# EAGLE design StickIt-PS2 (EAGLE 5.11)
AUTHOR: Dave Vandenbout / XESS Corp.; DIGIKEY#: 742C083331JPCT-ND; MANF: CTS Resistor Products; MANF#: 742C083331JPTR; MOUSER#: 774-742C083331JP; VERSION#: 1.0
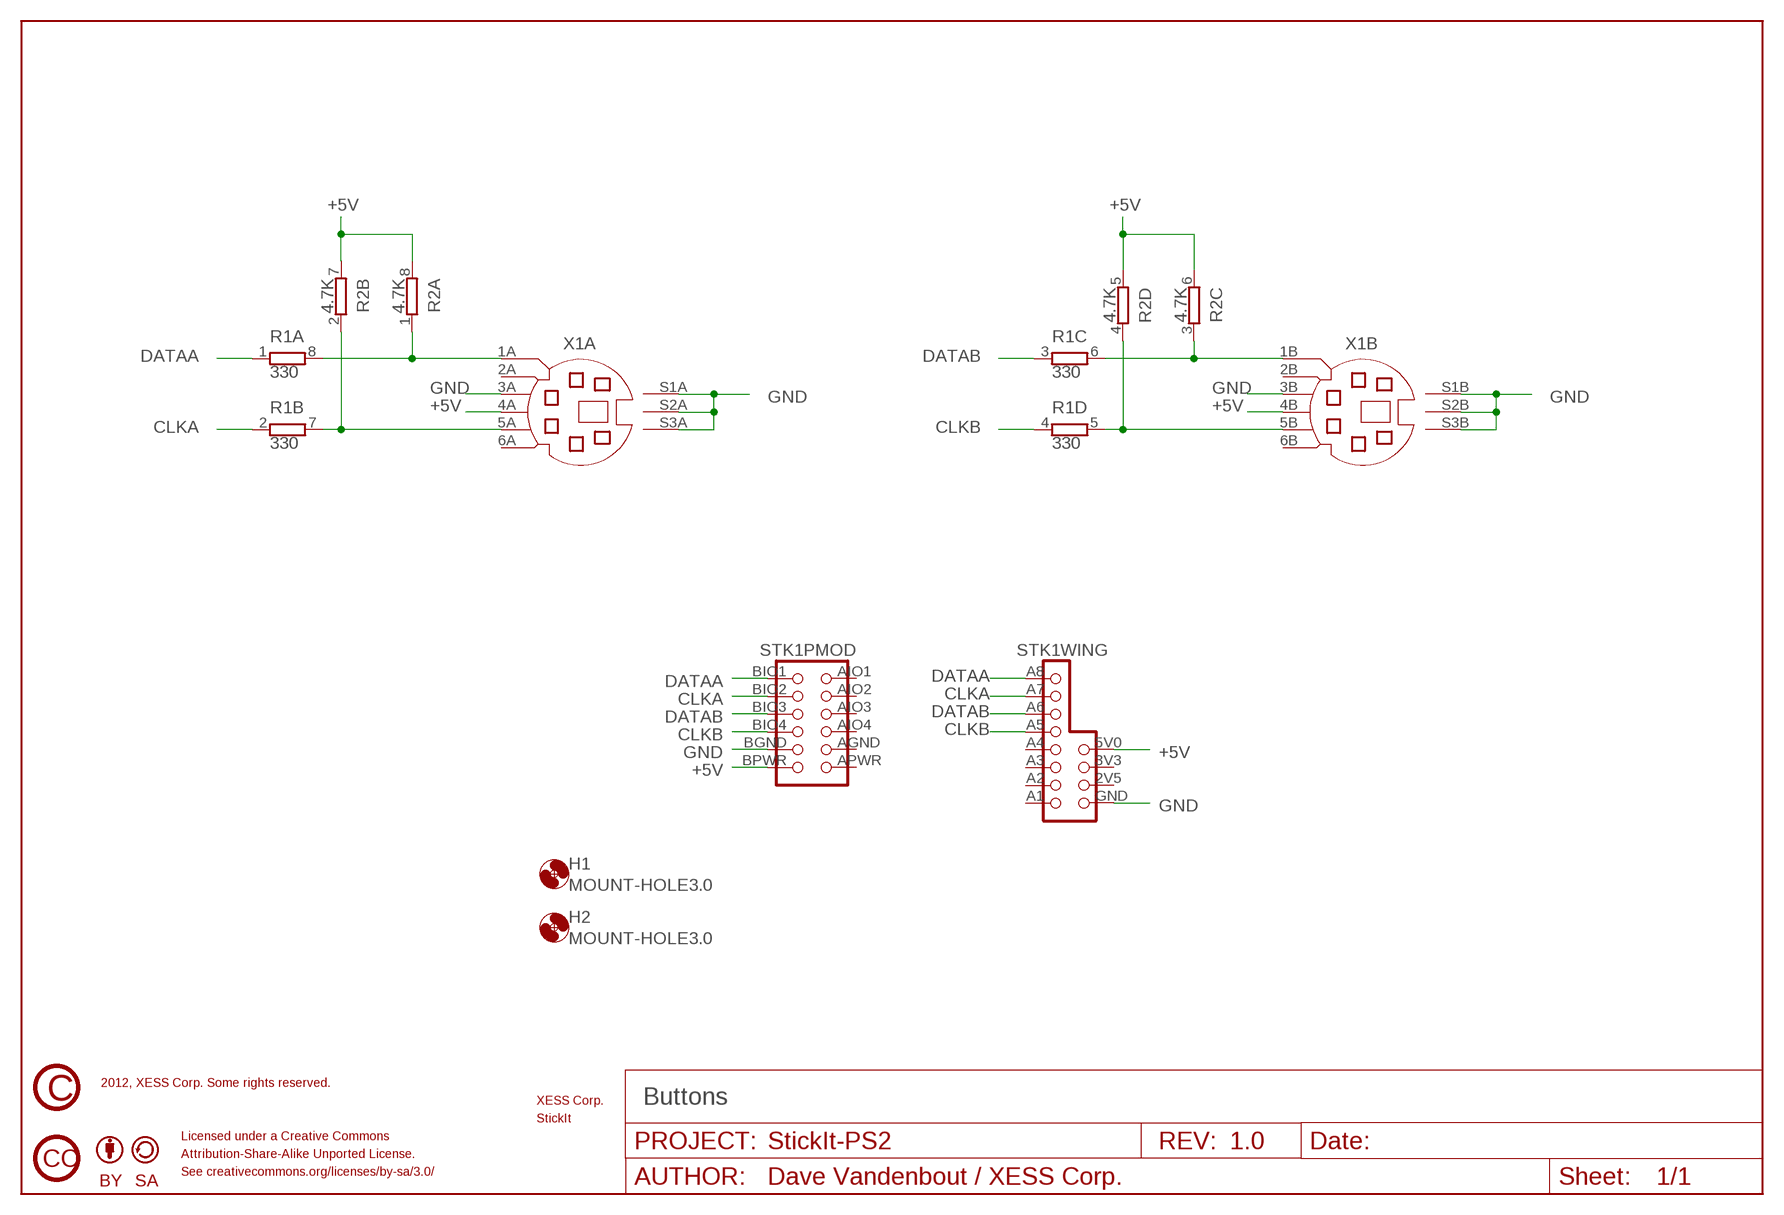
[diagram p0: schematic, sheet 1]

## Parts
H1  MOUNT-HOLE3.0  [3,0]
H2  MOUNT-HOLE3.0  [3,0]
R1  330  RES4742  [742C083]
R2  4.7K  RES4742  [742C083]
STK1  STICKIT-HEADER  STICKIT-HEADER1  [STICKIT-HEADER1]
U$1  LOGO-STICKIT700X200  [LOGO-STICKIT-700X200]
U$2  CC_CC  [CC_CC]
U$3  CC_BY  [CC_BY]
U$4  CC_SA  [CC_SA]
U$5  CC_COPYRIGHT  [CC_COPYRIGHT]
U$6  LOGO-XESS  LOGO-XESS700X120  [LOGO-XESS-700X120]
X1  MDIN06-DUAL  [MDIN06-DUAL]

## Nets
+5V: R2.5 R2.6 R2.7 R2.8 STK1.5V0(WING:5V) STK1.BPWR(PMOD:BPWR) X1.4A X1.4B
CLKA: R1.2 STK1.A7(WING:A7) STK1.BIO2(PMOD:BIO2)
CLKB: R1.4 STK1.A5(WING:A5) STK1.BIO4(PMOD:BIO4)
DATAA: R1.1 STK1.A8(WING:A8) STK1.BIO1(PMOD:BIO1)
DATAB: R1.3 STK1.A6(WING:A6) STK1.BIO3(PMOD:BIO3)
GND: STK1.BGND(PMOD:BGND) STK1.GND(WING:GND) X1.3A X1.3B X1.S1A(A:S1) X1.S1B(B:S1) X1.S2A(A:S2) X1.S2B(B:S2) X1.S3A(A:S3) X1.S3B(B:S3)
N$1: R1.6 R2.3 X1.1B
N$2: R1.5 R2.4 X1.5B
N$10: R1.8 R2.1 X1.1A
N$32: R1.7 R2.2 X1.5A
Unconnected: STK1.2V5(WING:2V5) STK1.3V3(WING:3V3) STK1.A1(WING:A1) STK1.A2(WING:A2) STK1.A3(WING:A3) STK1.A4(WING:A4) STK1.AGND(PMOD:AGND) STK1.AIO1(PMOD:AIO1) STK1.AIO2(PMOD:AIO2) STK1.AIO3(PMOD:AIO3) STK1.AIO4(PMOD:AIO4) STK1.APWR(PMOD:APWR) X1.2A X1.2B X1.6A X1.6B

## Notes on the sheet
- 2012, XESS Corp. Some rights reserved.
- Buttons
- Licensed under a Creative Commons
- Attribution-Share-Alike Unported License.
- See creativecommons.org/licenses/by-sa/3.0/

## Library data of the parts
H1 H2 = holes:MOUNT-HOLE: MOUNTING HOLE with drill center marker
R1 R2 = xess:RES4: Resistor 4-pack Package of four resistors.; DIGIKEY#: 742C083???JPCT-ND; MANF: CTS Resistor Products; MANF#: 742C083???JPTR; MOUSER#: 774-742C083???JP
STK1 = xess:STICKIT-HEADER: StickIt Header Combined PMOD and Papilio Wing header for use on StickIt add-on boards.
U$1 = xess:LOGO-STICKIT
U$2 = xess:CC_CC
U$3 = xess:CC_BY
U$4 = xess:CC_SA
U$5 = xess:CC_COPYRIGHT
U$6 = xess:LOGO-XESS
X1 = xess:MDIN06-DUAL: Dual 6-Pin Mini-DIN Female Socket; DIGIKEY#: 786580-1-ND; MANF: TE Connectivity; MANF#: 786580-1

## Net classes
1 power: clearance 0.254 mm

## Board
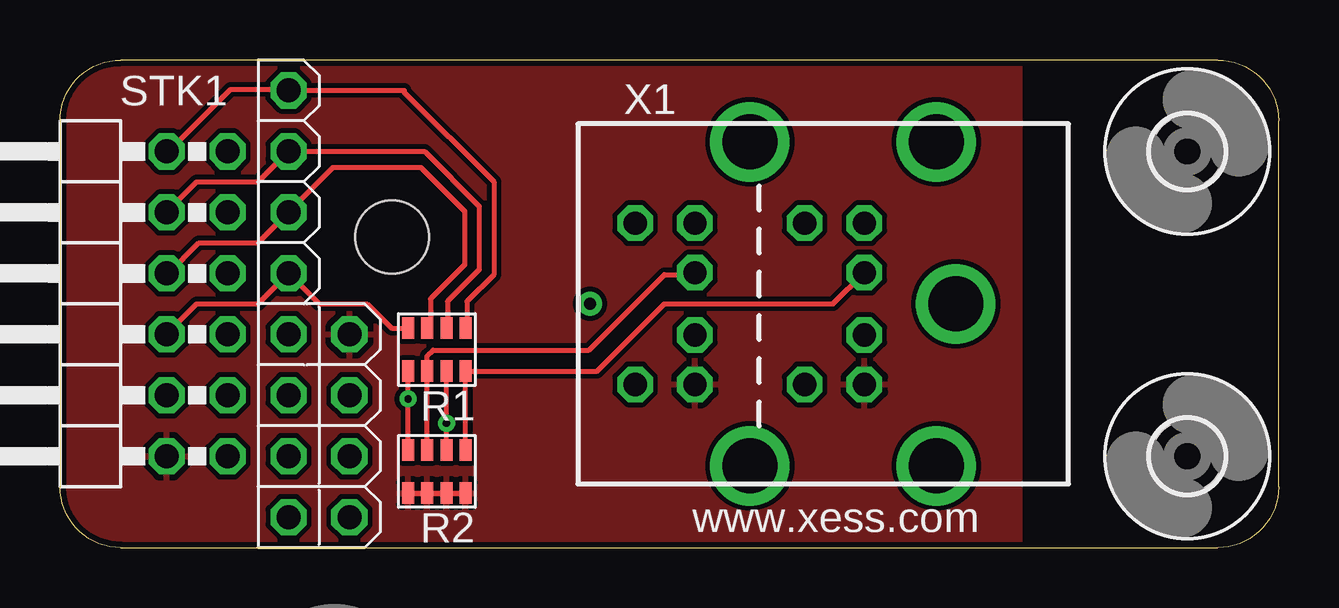
[diagram p1: board, top side]
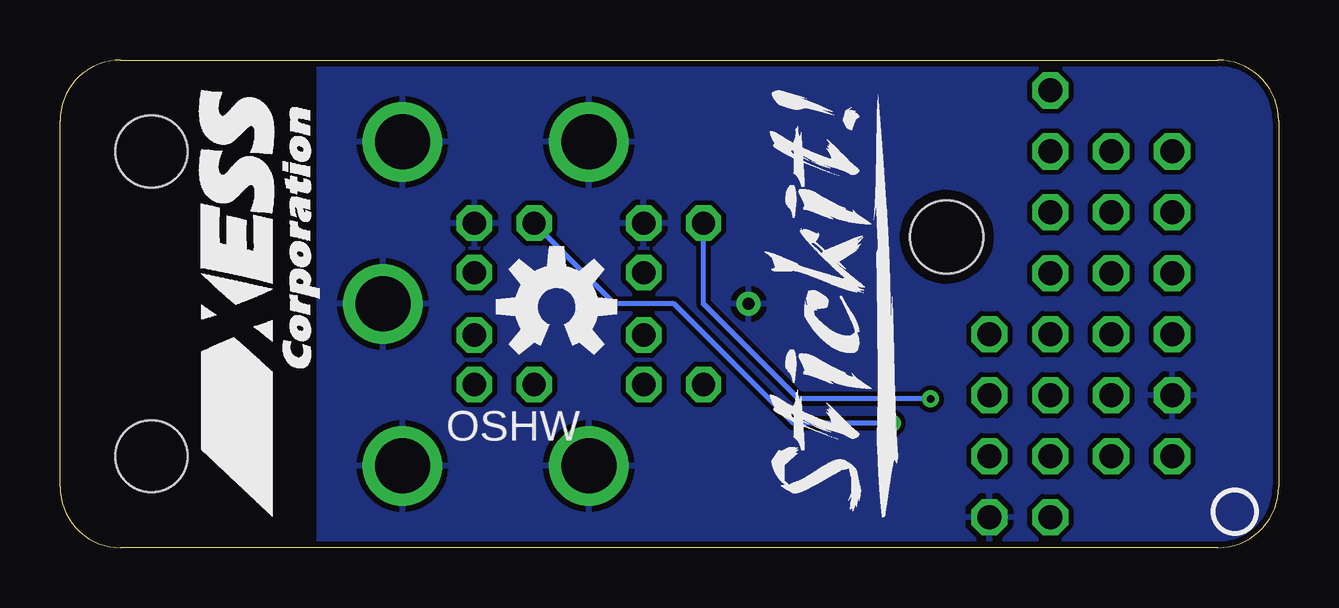
[diagram p2: board, bottom side, seen from below]

Size 50.8 x 20.32 mm. Coordinates in mm from the lower left corner, seen from the top.
Outline: 2.54,0 48.26,0 arc90 50.8,2.54 50.8,17.78 arc90 48.26,20.32 2.54,20.32 arc90 0,17.78 0,2.54 arc90 2.54,0
Copper layers (1*16): Top 0.035mm / dielectric 1.5mm / Bottom 0.035mm
Design rules "ITeadstudio_safe": minimum track width 8mil, minimum drill 12mil, track to track 8mil, track to pad 8mil, pad to pad 8mil, via to via 8mil, smd to smd 0mil, copper to edge 10mil, drill to drill 10mil, minimum pad ring 10mil, minimum via ring 8mil, stop-mask expansion 2mil, vias tented up to drill 100mil, thermal gap 10mil

### Footprints (pad centres in the part's own frame; a part is rotated, then mirrored left to right if it is on the bottom)
3,0 = hole 3: 0,0
742C083 = smd 0.5 x 0.9: 1 -0.4,-0.9; 2 0.4,-0.9; 3 1.2,-0.9; 4 2,-0.9; 5 2,0.9; 6 1.2,0.9; 7 0.4,0.9; 8 -0.4,0.9
STICKIT-HEADER1 = drill 1 octagon: 2V5 5.08,-15.24; 3V3 5.08,-12.7; 5V0 5.08,-10.16; A1 2.54,-17.78; A2 2.54,-15.24; A3 2.54,-12.7; A4 2.54,-10.16; A5 2.54,-7.62; A6 2.54,-5.08; A7 2.54,-2.54; A8 2.54,0; AGND 0,-12.7; AIO1 0,-2.54; AIO2 0,-5.08; AIO3 0,-7.62; AIO4 0,-10.16; APWR 0,-15.24; BGND -2.54,-12.7; BIO1 -2.54,-2.54; BIO2 -2.54,-5.08; BIO3 -2.54,-7.62; BIO4 -2.54,-10.16; BPWR -2.54,-15.24; GND 5.08,-17.78 | hole 3.048: 6.858,-6.096
MDIN06-DUAL = drill 0.97 octagon: 1A 1.3,8.51; 1B 1.3,15.57; 2A -1.3,8.51; 2B -1.3,15.57; 3A 3.36,8.51; 3B 3.36,15.57; 4A -3.36,8.51; 4B -3.36,15.57; 5A 3.36,11; 5B 3.36,18.06; 6A -3.36,11; 6B -3.36,18.06 | drill 2.29 round: S1A 0,4.699; S2A -6.75,5.51; S2B -6.75,13.28; S3A 6.75,5.51; S3B 6.75,13.28 | drill 0.5 round: S1B 0,19.939

### Placement (x,y rotation side)
H1  46.99,3.81 0 top
H2  46.99,16.51 0 top
R1  16.51,8.26 180 top
R2  16.51,3.17 180 top
STK1  6.99,19.05 0 top
U$1  15.88,1.27 90 bottom
U$2  11.43,-14.61 0 top  (outside the outline)
U$3  18.41,-13.34 0 top  (outside the outline)
U$4  23.5,-13.34 0 top  (outside the outline)
U$5  11.43,-5.71 0 top  (outside the outline)
U$6  41.91,1.27 90 bottom
X1  42.04,10.16 90 top

### Tracks (layer width: path | path; a pad name or v marks a point on that pad's centre or on a via)
+5V
  Top 0.203: R2.8 R2.7 R2.6 R2.5
  pour Top: 0,20.32 40.01,20.32 40.01,0 0,0
CLKA
  Top 0.203: 16.13,9.17 R1.2 16.15,9.2 16.15,10.26 17.48,11.58 17.48,14.22 15.19,16.51 STK1.A7 8.26,15.24 5.69,15.24 4.45,13.99 STK1.BIO2
CLKB
  Top 0.203: 14.4,9.04 R1.4 14.5,9.14 13.82,9.14 12.8,10.16 10.79,10.16 9.55,11.4 9.53,11.4 STK1.A5 8.26,10.16 5.69,10.16 4.45,8.91 STK1.BIO4
DATAA
  Top 0.203: 16.94,9.19 R1.1 16.97,9.21 16.97,10.26 18.09,11.38 18.09,15.24 14.35,18.97 14.35,19.05 STK1.A8 9.47,19.1 7.11,19.1 4.52,16.51 STK1.BIO1
DATAB
  Top 0.203: R1.3 15.44,9.29 15.44,10.36 16.87,11.79 16.87,14.02 15.04,15.85 11.38,15.85 9.53,13.99 STK1.A6 8.26,12.7 5.79,12.7 4.52,11.43 STK1.BIO3
GND
  pour Bottom: 0,0 40.01,0 40.01,20.32 0,20.32
N$1
  Top 0.203: R2.3 R1.6 15.31,8 15.54,8.23 22.05,8.23 25.2,11.38 26.39,11.38 X1.1B
N$2  (via drill 0.3)
  Top 0.203: R2.4 v14.51,6.2 R1.5
  Bottom 0.203: v14.5,6.2 v14.51,6.2 20.02,6.2 23.98,10.16 X1.5B
N$10
  Top 0.203: R2.1 R1.8 22.39,7.36 25.2,10.16 32.23,10.16 X1.1A
N$32  (via drill 0.3)
  Top 0.203: R2.2 v16.11,5.18 R1.7
  Bottom 0.203: v16.11,5.18 20.22,5.18 25.2,10.16 27.68,10.16 X1.5A

### Text on the board
tPlace: www.xess.com
bPlace: OSHW
tDocu: 2012, XESS Corp. Some rights reserved. | Licensed under a Creative Commons | Attribution-Share-Alike Unported License. | See creativecommons.org/licenses/by-sa/3.0/
_tDocu: 2012, XESS Corp. Some rights reserved. | C | Licensed under a Creative Commons | Attribution-Share-Alike Unported License. | CC | See creativecommons.org/licenses/by-sa/3.0/ | BY | SA